# EAGLE design juares-shield-proto-a1 (EAGLE 9.3.0)
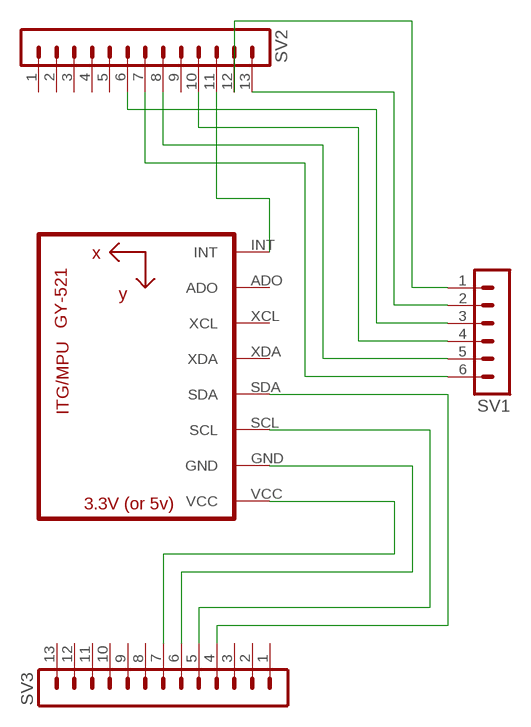
[diagram p0: schematic, sheet 1]

## Parts
SV1  MA06-1  [MA06-1]
SV2  MA13-1  [MA13-1]
SV3  MA13-1  [MA13-1]
U1  GY-521MPU6050  [GY-521]

## Nets
N$1: SV2.11 U1.INT
N$2: SV3.4 U1.SDA
N$3: SV3.6 U1.GND
N$4: SV3.7 U1.VCC
N$5: SV1.3 SV2.6
N$6: SV1.1 SV2.12
N$7: SV1.2 SV2.13
N$8: SV1.4 SV2.10
N$9: SV1.5 SV2.8
N$10: SV1.6 SV2.7
N$11: SV3.5 U1.SCL
Unconnected: SV2.1 SV2.2 SV2.3 SV2.4 SV2.5 SV2.9 SV3.1 SV3.2 SV3.3 SV3.8 SV3.9 SV3.10 SV3.11 SV3.12 SV3.13 U1.ADO U1.XCL U1.XDA

## Library data of the parts
SV1 = con-lstb:MA06-1: PIN HEADER; OC_FARNELL: unknown; OC_NEWARK: unknown
SV2 SV3 = con-lstb:MA13-1: PIN HEADER; OC_FARNELL: unknown; OC_NEWARK: unknown
U1 = gy-521:GY-521

## Board
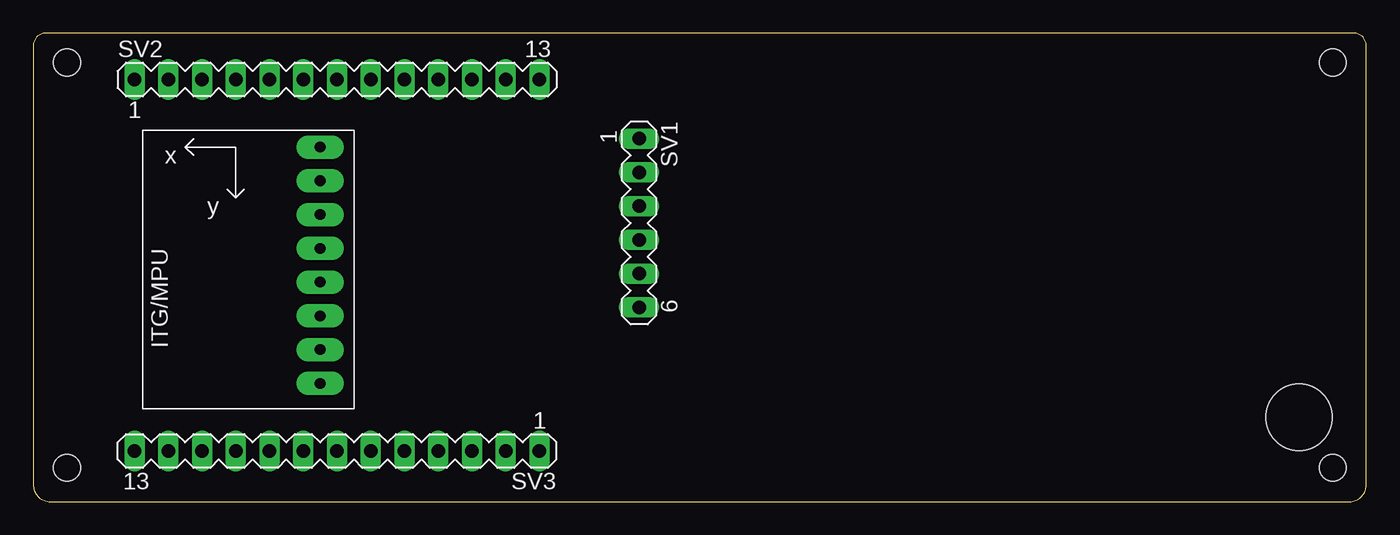
[diagram p1: board, top side]
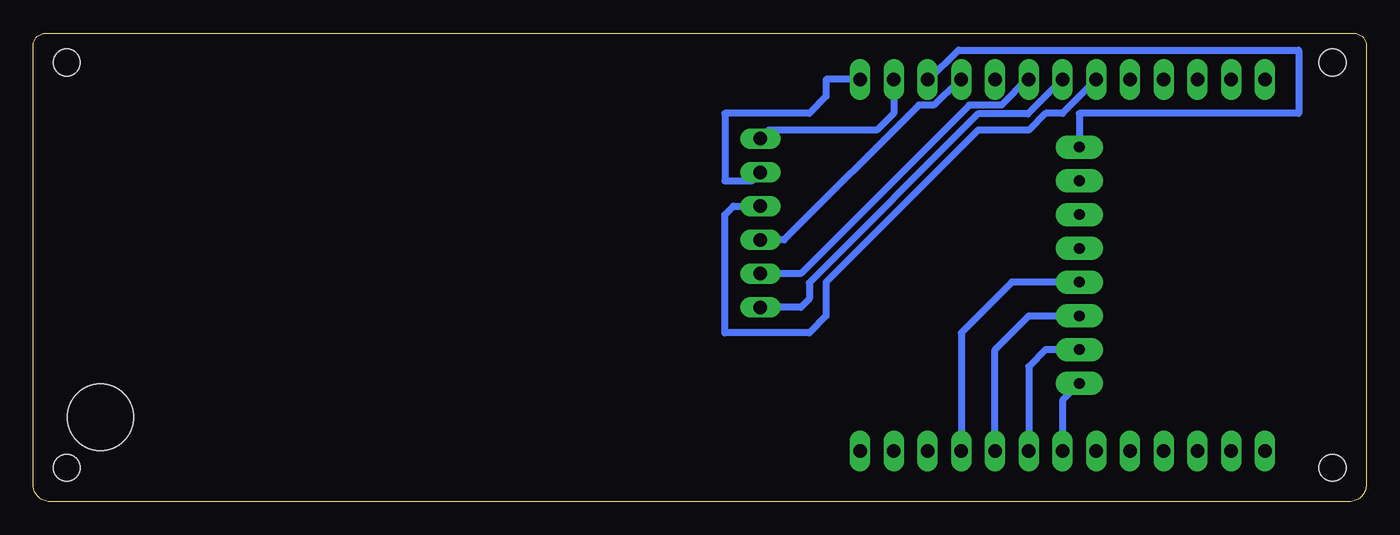
[diagram p2: board, bottom side, seen from below]

Size 100.31 x 35.23 mm. Coordinates in mm from the lower left corner, seen from the top.
Outline: 0,34.29 0,1.27 arc90 1.27,0 99.06,0 arc90 100.31,1.25 100.31,34.29 arc90 99.37,35.23 0.94,35.23 arc90 0,34.29
Copper layers (1*16): Top 0.035mm / dielectric 1.5mm / Bottom 0.035mm
Design rules "default": minimum track width 6mil, minimum drill 0.35mm, track to track 6mil, track to pad 6mil, pad to pad 6mil, via to via 6mil, smd to smd 6mil, copper to edge 40mil, drill to drill 6mil, minimum pad ring 10mil, minimum via ring 8mil, stop-mask expansion 4mil, vias tented up to drill 0mil, thermal gap 10mil
Holes 2.03 mm at 97.79,2.54 97.79,33.02 2.54,33.02 2.54,2.54
Holes 5 mm at 95.25,6.35

### Footprints (pad centres in the part's own frame; a part is rotated, then mirrored left to right if it is on the bottom)
MA06-1 = drill 1.016 long: 1 -6.35,0; 2 -3.81,0; 3 -1.27,0; 4 1.27,0; 5 3.81,0; 6 6.35,0
MA13-1 = drill 1.016 long: 1 -15.24,0; 2 -12.7,0; 3 -10.16,0; 4 -7.62,0; 5 -5.08,0; 6 -2.54,0; 7 0,0; 8 2.54,0; 9 5.08,0; 10 7.62,0; 11 10.16,0; 12 12.7,0; 13 15.24,0
GY-521 = drill 0.8 pad 1.778 long: ADO -8.89,-6.35; GND -8.89,6.35; INT -8.89,-8.89; SCL -8.89,3.81; SDA -8.89,1.27; VCC -8.89,8.89; XCL -8.89,-3.81; XDA -8.89,-1.27

### Placement (x,y rotation side)
SV1  45.59,20.95 270 top
SV2  22.86,31.75 0 top
SV3  22.86,3.81 180 top
U1  12.7,17.78 180 top

### Tracks (layer width: path | path; a pad name or v marks a point on that pad's centre or on a via)
N$1
  Bottom 0.508: U1.INT 21.59,29.21 5.08,29.21 5.08,33.96 30.68,33.96 32.89,31.75 SV2.11
N$2
  Bottom 0.508: U1.SDA 26.67,16.51 30.48,12.7 SV3.4
N$3
  Bottom 0.508: U1.GND 24.13,11.43 25.4,10.16 SV3.6
N$4
  Bottom 0.508: U1.VCC 22.86,7.62 SV3.7
N$5
  Bottom 0.508: SV2.6 22.86,29.21 24.13,29.21 25.4,27.94 29.21,27.94 40.64,16.51 40.64,13.97 41.91,12.7 48.26,12.7 48.26,21.59 47.62,22.23 SV1.3
N$6
  Bottom 0.152: 45.09,27.3 SV1.1
  Bottom 0.508: SV2.12 35.56,29.21 36.83,27.94 44.96,27.94 SV1.1
N$7
  Bottom 0.508: SV2.13 40.64,31.75 40.64,30.48 41.91,29.21 48.26,29.21 48.26,24.13 46.23,24.13 SV1.2
N$8
  Bottom 0.508: SV1.4 43.81,19.68 33.68,29.82 32.54,29.82 31.85,30.5 SV2.10
N$9
  Bottom 0.508: SV2.8 25.53,31.75 27.46,29.82 29.87,29.82 42.55,17.14 SV1.5
N$10
  Bottom 0.508: SV2.7 25.45,29.16 29.21,29.16 41.91,16.46 41.91,15.24 42.55,14.61 SV1.6
N$11
  Bottom 0.508: SV3.5 27.94,11.43 25.4,13.97 U1.SCL